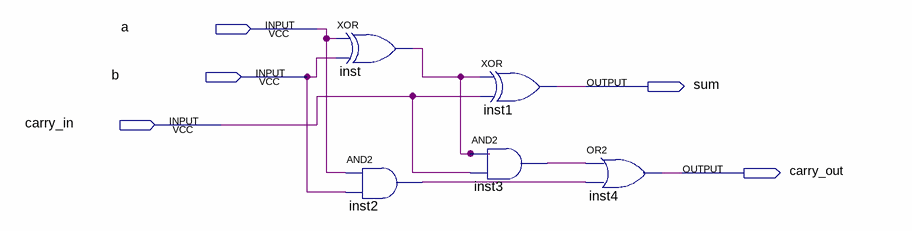
[diagram p0: schematic sheet]
// Quartus schematic FullAdder.bdf as structural Verilog: 5 symbols, 5 pins
module FullAdder (
  input  a,
  input  b,
  input  carry_in,
  output sum,
  output carry_out
);

  wire inst2_out, inst3_out, inst_out;

  xor inst (inst_out, a, b);
  and inst2 (inst2_out, a, b);
  xor inst1 (sum, inst_out, carry_in);
  and inst3 (inst3_out, inst_out, carry_in);
  or inst4 (carry_out, inst3_out, inst2_out);
endmodule
